# EAGLE schematic untitled (EAGLE 8.6.0)
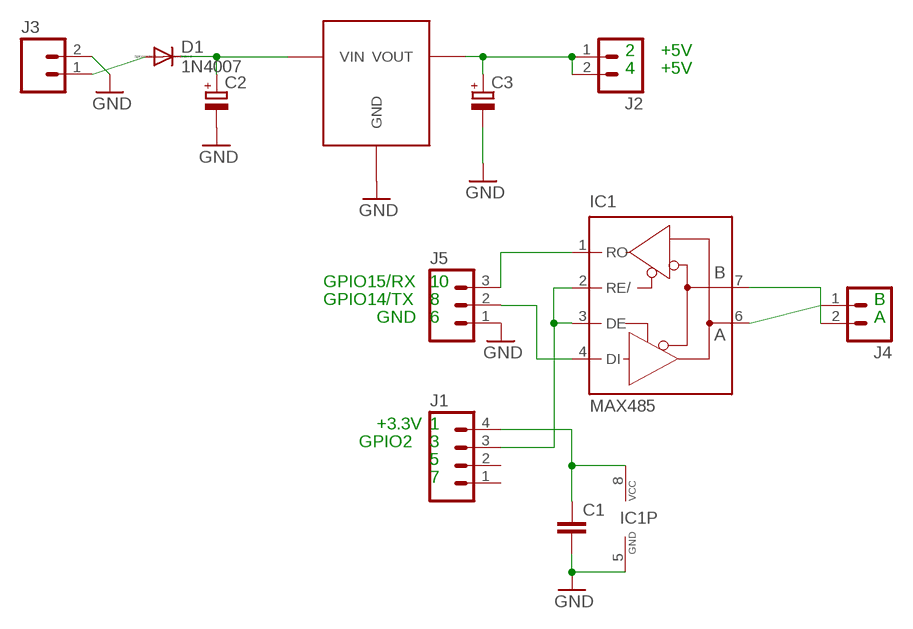
[diagram p0: schematic, sheet 1]

## Parts
C1  C-EU050-025X075  [C050-025X075]
C2  CPOL-EUE2-4  [E2-4]
C3  CPOL-EUE2-4  [E2-4]
D1  1N4007  [DO41-10]
IC1  MAX485  [DIL08]
J1  M04  [1X04]
J2  M02  [1X02]
J3  M02-SCREW-3.5MM3.5MM  [SCREWTERMINAL-3.5MM-2]
J4  M02-SCREW-3.5MM3.5MM  [SCREWTERMINAL-3.5MM-2]
J5  M03  [1X03]
U$1  DSUN-MP1584  [DSUN-MP1584]

## Nets
3.3V: C1.1 IC1.8(VCC) J1.4
5V: C3.+ J2.1 J2.2 U$1.OUT1(VOUT)
A: IC1.6(A) J4.1
B: IC1.7(B) J4.2
EN: IC1.2(RE/) IC1.3(DE) J1.3
GND: C1.2 C2.- C3.- IC1.5(GND) J3.2 J5.1 U$1.GND1(GND)
N$1: D1.A J3.1
N$2: C2.+ D1.C U$1.IN1(VIN)
RX: IC1.1(RO) J5.3
TX: IC1.4(DI) J5.2
Unconnected: J1.1 J1.2

## Notes on the sheet
- 2 | +5V
- 4 | +5V
- GPIO15/RX | 10
- GPIO14/TX | 8 | B
- GND | 6 | A
- +3.3V | 1
- GPIO2 | 3
- 5
- 7

## Library data of the parts
C1 = custom:C-EU: CAPACITOR, European symbol
C2 C3 = custom:CPOL-EU: POLARIZED CAPACITOR, European symbol
D1 = custom:1N4007: DIODE general purpose rectifier, 1 A
IC1 = custom:MAX485: RS485 TRANSEIVER; MPN: MAX481CPA+; OC_FARNELL: unknown; OC_NEWARK: 99K3445
J1 = custom:M04
J2 = custom:M02
J3 J4 = custom:M02-SCREW-3.5MM: Standard 2-pin 0.1" header. Use with - straight break away headers ( PRT-00116) - right angle break away headers (PRT-00553) - swiss pins (PRT-00743) - machine pins (PRT-00117) - female headers (PRT-00115) Molex polarized connector foot print use with: PRT-08233 with associated crimp pins and housings. 2.54_SCREWTERM for use with PRT-10571. 3.5mm Screw Terminal footprints for PRT-08084 5mm Screw Terminal footprints for use with PRT-08432; PROD_ID: CONN-08399
J5 = custom:M03
U$1 = custom:DSUN-MP1584: Switching Variable Regulator - 0.8V-18V Input: 4.5V-28V Max current: 3A